# Altium schematic sheet HIGHSPEED_v0_NM.SchDoc
size A2
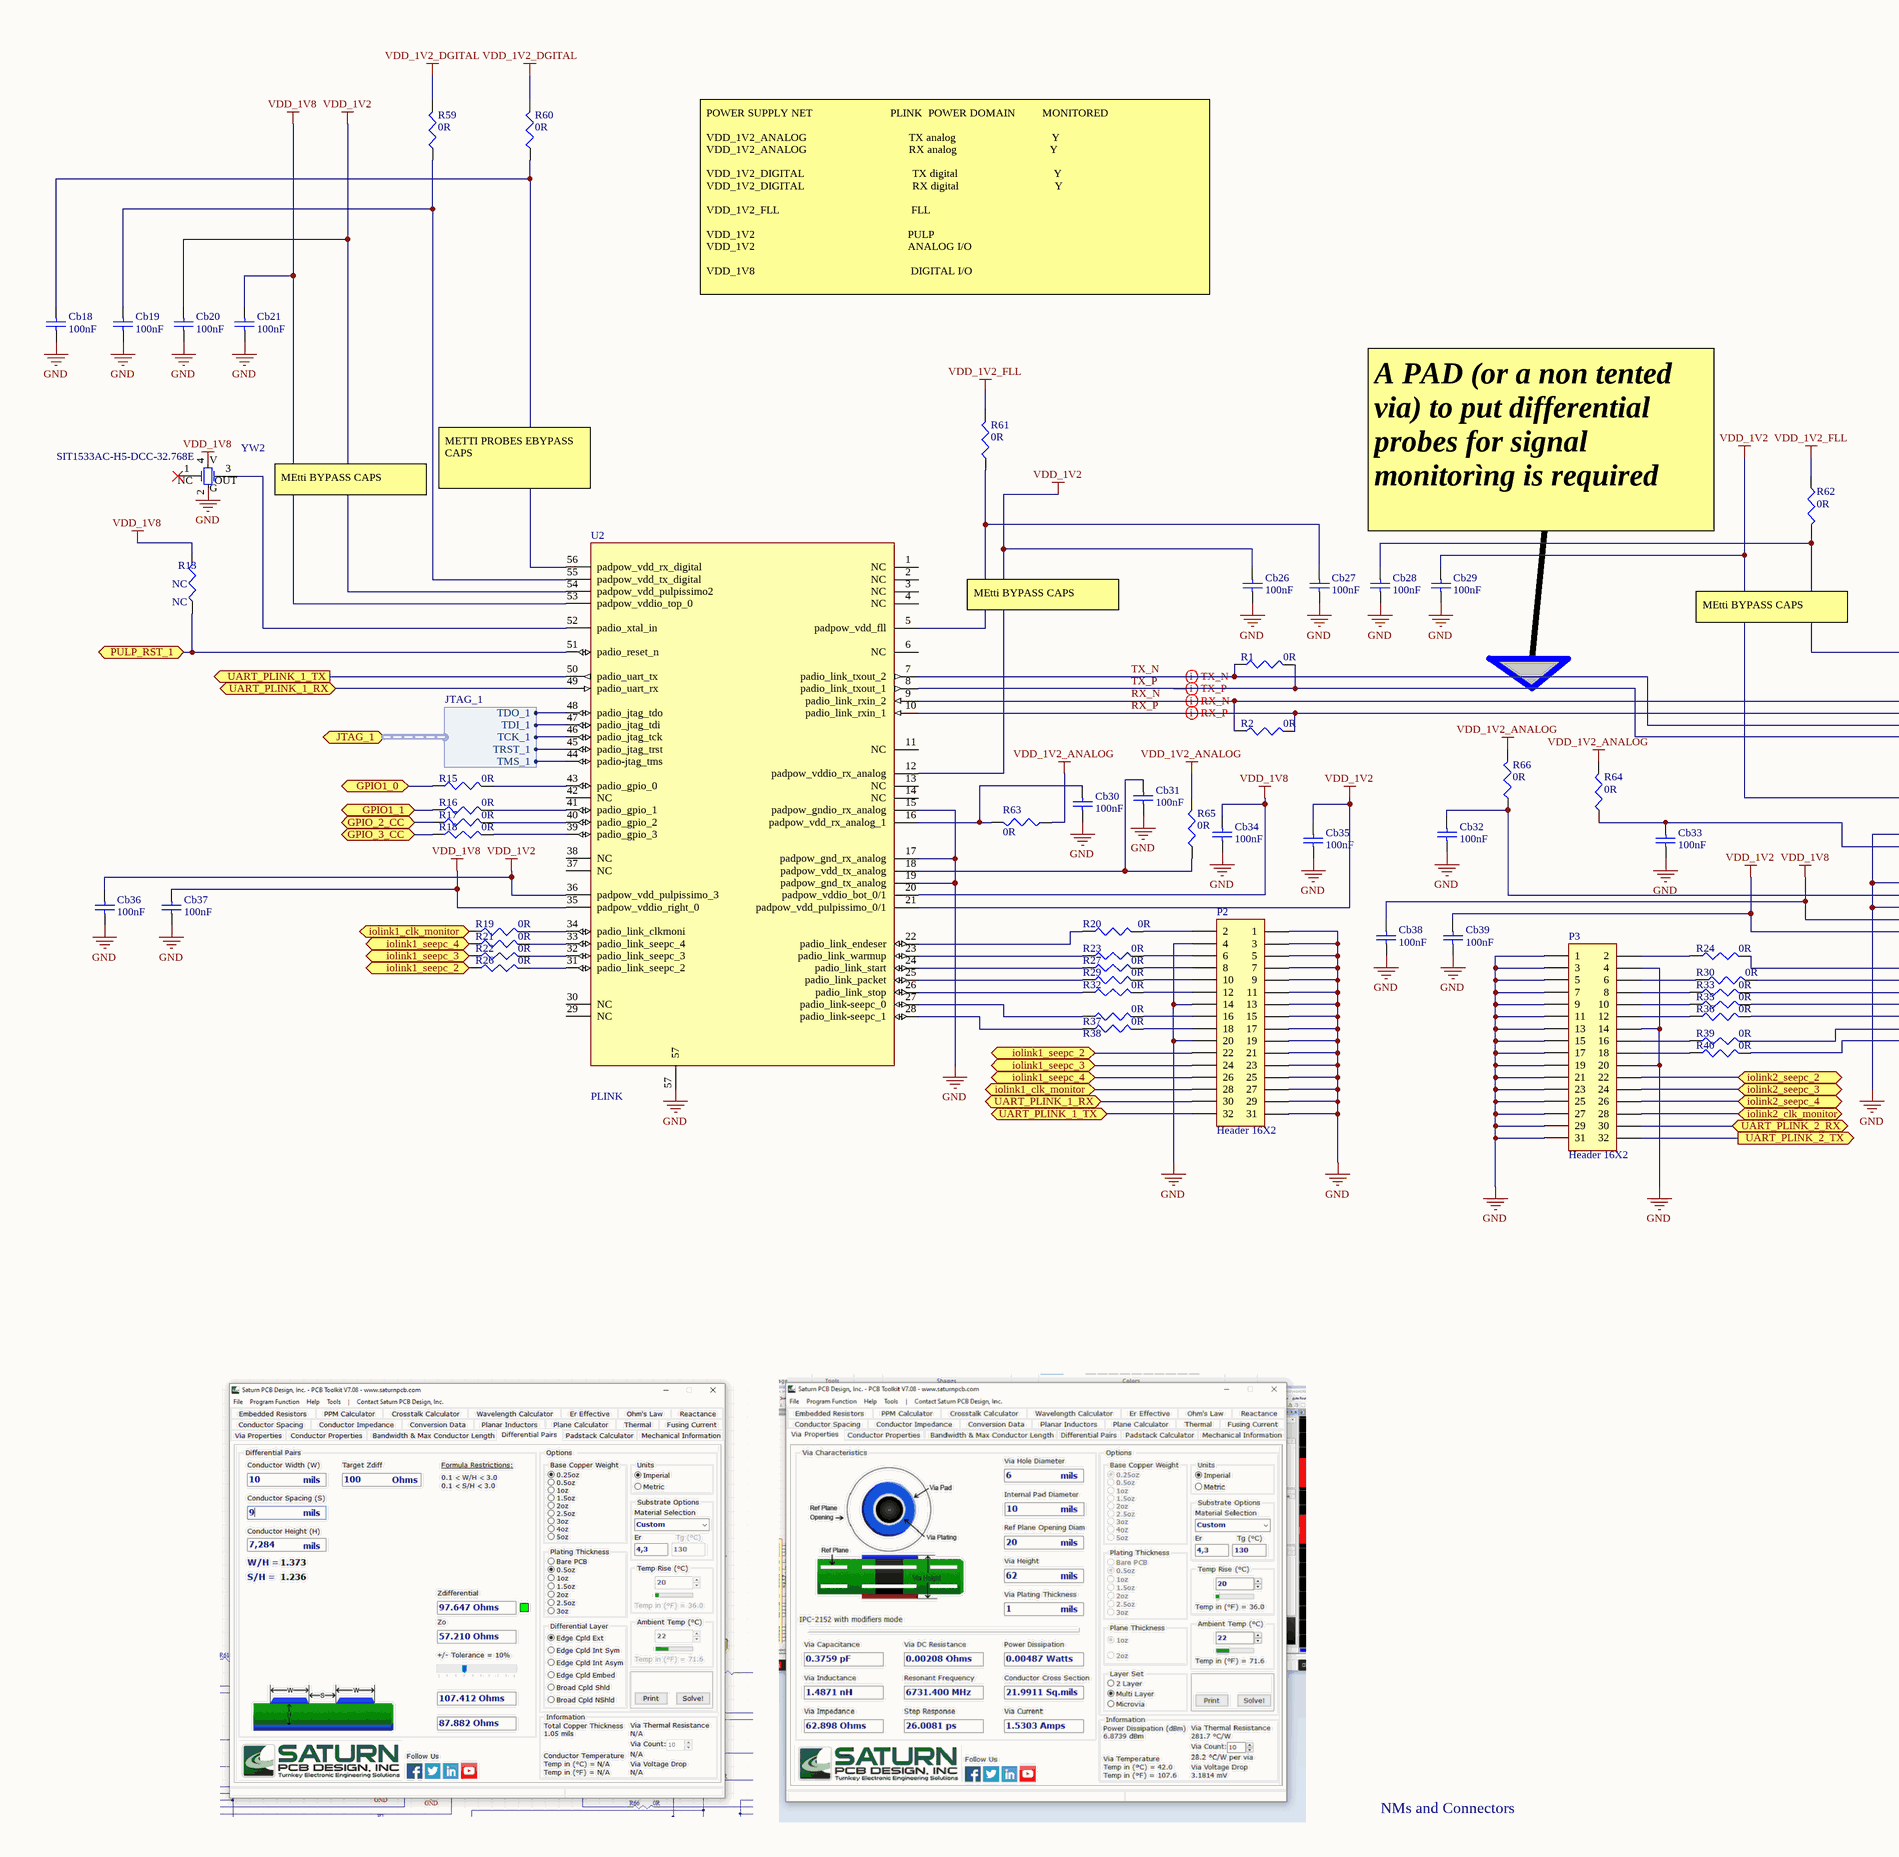
[diagram p0: HIGHSPEED_v0_NM.SchDoc, left]
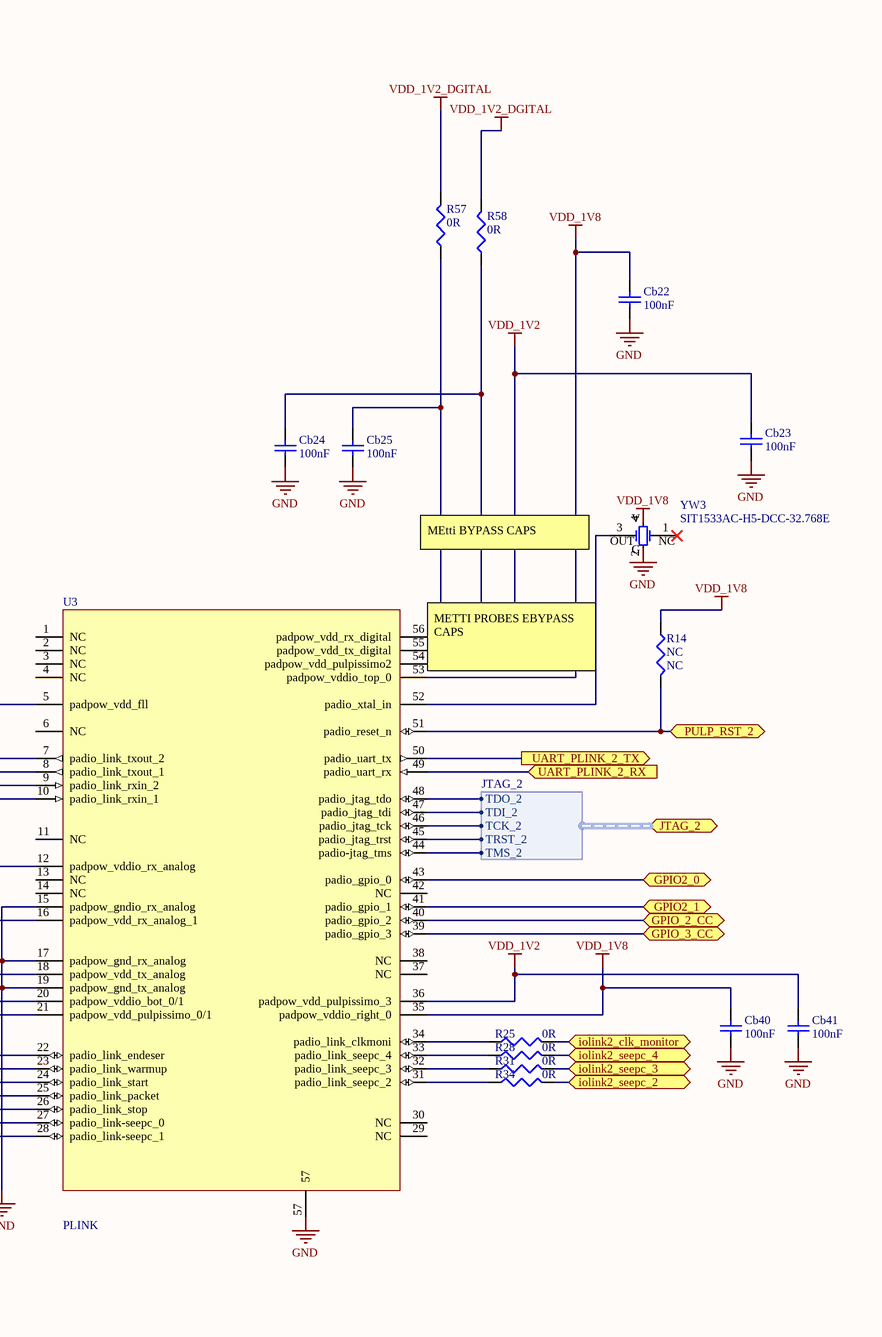
[diagram p1: HIGHSPEED_v0_NM.SchDoc, right]

## Parts
Cb18  value 100nF  [c0603-Murata-GR]  (hidden comment: GRM187R61A226ME15D)
Cb19  value 100nF  [c0603-Murata-GR]  (hidden comment: GRM187R61A226ME15D)
Cb20  value 100nF  [c0603-Murata-GR]  (hidden comment: GRM187R61A226ME15D)
Cb21  value 100nF  [c0603-Murata-GR]  (hidden comment: GRM187R61A226ME15D)
Cb22  value 100nF  [c0603-Murata-GR]  (hidden comment: GRM187R61A226ME15D)
Cb23  value 100nF  [c0603-Murata-GR]  (hidden comment: GRM187R61A226ME15D)
Cb24  value 100nF  [c0603-Murata-GR]  (hidden comment: GRM187R61A226ME15D)
Cb25  value 100nF  [c0603-Murata-GR]  (hidden comment: GRM187R61A226ME15D)
Cb26  value 100nF  [c0603-Murata-GR]  (hidden comment: GRM187R61A226ME15D)
Cb27  value 100nF  [c0603-Murata-GR]  (hidden comment: GRM187R61A226ME15D)
Cb28  value 100nF  [c0603-Murata-GR]  (hidden comment: GRM187R61A226ME15D)
Cb29  value 100nF  [c0603-Murata-GR]  (hidden comment: GRM187R61A226ME15D)
Cb30  value 100nF  [c0603-Murata-GR]  (hidden comment: GRM187R61A226ME15D)
Cb31  value 100nF  [c0603-Murata-GR]  (hidden comment: GRM187R61A226ME15D)
Cb32  value 100nF  [c0603-Murata-GR]  (hidden comment: GRM187R61A226ME15D)
Cb33  value 100nF  [c0603-Murata-GR]  (hidden comment: GRM187R61A226ME15D)
Cb34  value 100nF  [c0603-Murata-GR]  (hidden comment: GRM187R61A226ME15D)
Cb35  value 100nF  [c0603-Murata-GR]  (hidden comment: GRM187R61A226ME15D)
Cb36  value 100nF  [c0603-Murata-GR]  (hidden comment: GRM187R61A226ME15D)
Cb37  value 100nF  [c0603-Murata-GR]  (hidden comment: GRM187R61A226ME15D)
Cb38  value 100nF  [c0603-Murata-GR]  (hidden comment: GRM187R61A226ME15D)
Cb39  value 100nF  [c0603-Murata-GR]  (hidden comment: GRM187R61A226ME15D)
Cb40  value 100nF  [c0603-Murata-GR]  (hidden comment: GRM187R61A226ME15D)
Cb41  value 100nF  [c0603-Murata-GR]  (hidden comment: GRM187R61A226ME15D)
P2  Header 16X2  [HDR2X16]
P3  Header 16X2  [HDR2X16]
R1  0R  [J1-0603]
R2  0R  [J1-0603]
R13  NC  [0402]
R14  NC  [0402]
R15  0R  [0402]
R16  0R  [0402]
R17  0R  [0402]
R18  0R  [0402]
R19  0R  [0402]
R20  0R  [0402]
R21  0R  [0402]
R22  0R  [0402]
R23  0R  [0402]
R24  0R  [0402]
R25  0R  [0402]
R26  0R  [0402]
R27  0R  [0402]
R28  0R  [0402]
R29  0R  [0402]
R30  0R  [0402]
R31  0R  [0402]
R32  0R  [0402]
R33  0R  [0402]
R34  0R  [0402]
R35  0R  [0402]
R36  0R  [0402]
R37  0R  [0402]
R38  0R  [0402]
R39  0R  [0402]
R40  0R  [0402]
R57  0R  [C1206]
R58  0R  [C1206]
R59  0R  [C1206]
R60  0R  [C1206]
R61  0R  [C1206]
R62  0R  [C1206]
R63  0R  [C1206]
R64  0R  [C1206]
R65  0R  [C1206]
R66  0R  [C1206]
U2  PLINK  [QFN56_M]
U3  PLINK  [QFN56_M]
YW2  SIT1533AC-H5-DCC-32.768E  [SiT1533-C]
YW3  SIT1533AC-H5-DCC-32.768E  [SiT1533-C]

## Ports
GPIO1_0 (bidir), GPIO1_1 (bidir), GPIO2_0 (bidir), GPIO2_1 (bidir), GPIO_2_CC (bidir), GPIO_3_CC (bidir), iolink1_clk_monitor (bidir), iolink1_seepc_2 (bidir), iolink1_seepc_3 (bidir), iolink1_seepc_4 (bidir), iolink2_clk_monitor (bidir), iolink2_seepc_2 (bidir), iolink2_seepc_3 (bidir), iolink2_seepc_4 (bidir), JTAG_1 (harness JTAG_1), JTAG_2 (harness JTAG_2), PULP_RST_1 (bidir), PULP_RST_2 (bidir), UART_PLINK_1_RX (bidir), UART_PLINK_1_TX, UART_PLINK_1_TX (out), UART_PLINK_2_RX, UART_PLINK_2_RX (in), UART_PLINK_2_TX (out)

## Harnesses
JTAG_1: TCK_1, TDI_1, TDO_1, TMS_1, TRST_1
JTAG_2: TCK_2, TDI_2, TDO_2, TMS_2, TRST_2

## Nets
GND: Cb18.1 Cb19.1 Cb20.1 Cb21.1 Cb22.1 Cb23.1 Cb24.1 Cb25.1 Cb26.1 Cb27.1 Cb28.1 Cb29.1 Cb30.1 Cb31.1 Cb32.1 Cb33.1 Cb34.1 Cb35.1 Cb36.1 Cb37.1 Cb38.1 Cb39.1 Cb40.1 Cb41.1 P2.1 P2.3 P2.4 P2.5 P2.7 P2.9 P2.11 P2.13 P2.14 P2.15 P2.17 P2.19 P2.20 P2.21 P2.23 P2.25 P2.27 P2.29 P2.31 P3.1 P3.3 P3.4 P3.5 P3.7 P3.9 P3.11 P3.13 P3.14 P3.15 P3.17 P3.19 P3.20 P3.21 P3.23 P3.25 P3.27 P3.29 P3.31 U2.15(padpow_gndio_rx_analog) U2.17(padpow_gnd_rx_analog) U2.19(padpow_gnd_tx_analog) U2.57 U3.15(padpow_gndio_rx_analog) U3.17(padpow_gnd_rx_analog) U3.19(padpow_gnd_tx_analog) U3.57 YW2.2(GND) YW3.2(GND)
VDD_1V2: Cb20.2 Cb23.2 Cb26.2 Cb29.2 Cb35.2 Cb36.2 Cb39.2 Cb41.2 U2.12(padpow_vddio_rx_analog) U2.21(padpow_vdd_pulpissimo_0/1) U2.36(padpow_vdd_pulpissimo_3) U2.54(padpow_vdd_pulpissimo2) U3.12(padpow_vddio_rx_analog) U3.21(padpow_vdd_pulpissimo_0/1) U3.36(padpow_vdd_pulpissimo_3) U3.54(padpow_vdd_pulpissimo2)
VDD_1V2_ANALOG: R63.2 R64.1 R65.1 R66.1
VDD_1V2_DGITAL: R57.1 R58.1 R59.1 R60.1
VDD_1V2_FLL: R61.1 R62.2
VDD_1V8: Cb21.2 Cb22.2 Cb34.2 Cb37.2 Cb38.2 Cb40.2 R13.2 R14.2 U2.20(padpow_vddio_bot_0/1) U2.35(padpow_vddio_right_0) U2.53(padpow_vddio_top_0) U3.20(padpow_vddio_bot_0/1) U3.35(padpow_vddio_right_0) U3.53(padpow_vddio_top_0) YW2.4(VDD) YW3.4(VDD)
GPIO1_0: R15.2 ; port GPIO1_0
GPIO1_1: R16.2 ; port GPIO1_1
GPIO2_0: U3.43(padio_gpio_0) ; port GPIO2_0
GPIO2_1: U3.41(padio_gpio_1) ; port GPIO2_1
GPIO_2_CC: R17.2 U3.40(padio_gpio_2) ; port GPIO_2_CC
GPIO_3_CC: R18.2 U3.39(padio_gpio_3) ; port GPIO_3_CC
iolink1_clk_monitor: P2.28 R19.2 ; port iolink1_clk_monitor
iolink1_seepc_2: P2.22 R26.2 ; port iolink1_seepc_2
iolink1_seepc_3: P2.24 R22.2 ; port iolink1_seepc_3
iolink1_seepc_4: P2.26 R21.2 ; port iolink1_seepc_4
iolink2_clk_monitor: P3.28 R25.1 ; port iolink2_clk_monitor
iolink2_seepc_2: P3.22 R34.1 ; port iolink2_seepc_2
iolink2_seepc_3: P3.24 R31.1 ; port iolink2_seepc_3
iolink2_seepc_4: P3.26 R28.1 ; port iolink2_seepc_4
PULP_RST_1: R13.1 U2.51(padio_reset_n) ; port PULP_RST_1
PULP_RST_2: R14.1 U3.51(padio_reset_n) ; port PULP_RST_2
RX_N: R2.2 U2.9(padio_link_rxin_2) U3.7(padio_link_txout_2)
RX_P: R2.1 U2.10(padio_link_rxin_1) U3.8(padio_link_txout_1)
TX_N: R1.2 U2.7(padio_link_txout_2) U3.9(padio_link_rxin_2)
TX_P: R1.1 U2.8(padio_link_txout_1) U3.10(padio_link_rxin_1)
UART_PLINK_1_RX: P2.30 U2.49(padio_uart_rx) ; port UART_PLINK_1_RX
UART_PLINK_1_TX: P2.32 U2.50(padio_uart_tx) ; port UART_PLINK_1_TX
UART_PLINK_2_RX: P3.30 U3.49(padio_uart_rx) ; port UART_PLINK_2_RX
UART_PLINK_2_TX: P3.32 U3.50(padio_uart_tx) ; port UART_PLINK_2_TX
NetCb18_2: Cb18.2 R60.2 U2.56(padpow_vdd_rx_digital)
NetCb19_2: Cb19.2 R59.2 U2.55(padpow_vdd_tx_digital)
NetCb24_2: Cb24.2 R58.2 U3.55(padpow_vdd_tx_digital)
NetCb25_2: Cb25.2 R57.2 U3.56(padpow_vdd_rx_digital)
NetCb27_2: Cb27.2 R61.2 U2.5(padpow_vdd_fll)
NetCb28_2: Cb28.2 R62.1 U3.5(padpow_vdd_fll)
NetCb30_2: Cb30.2 R63.1 U2.16(padpow_vdd_rx_analog_1)
NetCb31_2: Cb31.2 R65.2 U2.18(padpow_vdd_tx_analog)
NetCb32_2: Cb32.2 R66.2 U3.18(padpow_vdd_tx_analog)
NetCb33_2: Cb33.2 R64.2 U3.16(padpow_vdd_rx_analog_1)
NetP2_2: P2.2 R20.2
NetP2_6: P2.6 R23.2
NetP2_8: P2.8 R27.2
NetP2_10: P2.10 R29.2
NetP2_12: P2.12 R32.2
NetP2_16: P2.16 R37.2
NetP2_18: P2.18 R38.2
NetP3_2: P3.2 R24.2
NetP3_6: P3.6 R30.2
NetP3_8: P3.8 R33.2
NetP3_10: P3.10 R35.2
NetP3_12: P3.12 R36.2
NetP3_16: P3.16 R39.2
NetP3_18: P3.18 R40.2
NetR15_1: R15.1 U2.43(padio_gpio_0)
NetR16_1: R16.1 U2.41(padio_gpio_1)
NetR17_1: R17.1 U2.40(padio_gpio_2)
NetR18_1: R18.1 U2.39(padio_gpio_3)
NetR19_1: R19.1 U2.34(padio_link_clkmoni)
NetR20_1: R20.1 U2.22(padio_link_endeser)
NetR21_1: R21.1 U2.33(padio_link_seepc_4)
NetR22_1: R22.1 U2.32(padio_link_seepc_3)
NetR23_1: R23.1 U2.23(padio_link_warmup)
NetR24_1: R24.1 U3.22(padio_link_endeser)
NetR25_2: R25.2 U3.34(padio_link_clkmoni)
NetR26_1: R26.1 U2.31(padio_link_seepc_2)
NetR27_1: R27.1 U2.24(padio_link_start)
NetR28_2: R28.2 U3.33(padio_link_seepc_4)
NetR29_1: R29.1 U2.25(padio_link_packet)
NetR30_1: R30.1 U3.23(padio_link_warmup)
NetR31_2: R31.2 U3.32(padio_link_seepc_3)
NetR32_1: R32.1 U2.26(padio_link_stop)
NetR33_1: R33.1 U3.24(padio_link_start)
NetR34_2: R34.2 U3.31(padio_link_seepc_2)
NetR35_1: R35.1 U3.25(padio_link_packet)
NetR36_1: R36.1 U3.26(padio_link_stop)
NetR37_1: R37.1 U2.27(padio_link-seepc_0)
NetR38_1: R38.1 U2.28(padio_link-seepc_1)
NetR39_1: R39.1 U3.27(padio_link-seepc_0)
NetR40_1: R40.1 U3.28(padio_link-seepc_1)
NetU2_44: U2.44(padio-jtag_tms) ; port JTAG_1.TMS_1
NetU2_45: U2.45(padio_jtag_trst) ; port JTAG_1.TRST_1
NetU2_46: U2.46(padio_jtag_tck) ; port JTAG_1.TCK_1
NetU2_47: U2.47(padio_jtag_tdi) ; port JTAG_1.TDI_1
NetU2_48: U2.48(padio_jtag_tdo) ; port JTAG_1.TDO_1
NetU2_52: U2.52(padio_xtal_in) YW2.3(OUT)
NetU3_44: U3.44(padio-jtag_tms) ; port JTAG_2.TMS_2
NetU3_45: U3.45(padio_jtag_trst) ; port JTAG_2.TRST_2
NetU3_46: U3.46(padio_jtag_tck) ; port JTAG_2.TCK_2
NetU3_47: U3.47(padio_jtag_tdi) ; port JTAG_2.TDI_2
NetU3_48: U3.48(padio_jtag_tdo) ; port JTAG_2.TDO_2
NetU3_52: U3.52(padio_xtal_in) YW3.3(OUT)

Not connected (* = marked no-connect by the designer): U2 1(NC) 2(NC) 3(NC) 4(NC) 6(NC) 11(NC) 13(NC) 14(NC) 29(NC) 30(NC) 37(NC) 38(NC) 42(NC); U3 1(NC) 2(NC) 3(NC) 4(NC) 6(NC) 11(NC) 13(NC) 14(NC) 29(NC) 30(NC) 37(NC) 38(NC) 42(NC); YW2 1(NC)*; YW3 1(NC)*

## Layout directives
differential pair: RX_N, RX_P, TX_N, TX_P

## Notes on the sheet
- POWER SUPPLY NET                          PLINK  POWER DOMAIN         MONITORED
  VDD_1V2_ANALOG                                  TX analog                                Y
  VDD_1V2_ANALOG                                  RX analog                               Y
  VDD_1V2_DIGITAL                                    TX digital                                Y
  VDD_1V2_DIGITAL                                    RX digital                                Y
  VDD_1V2_FLL                                            FLL
  VDD_1V2                                                   PULP
  VDD_1V2                                                   ANALOG I/O
  VDD_1V8                                                    DIGITAL I/O
- METTI PROBES EBYPASS CAPS
- MEtti BYPASS CAPS
- A PAD (or a non tented via) to put differential probes for signal monitorìng is required
- (near YW3) MEtti BYPASS CAPS
- (near U3) METTI PROBES EBYPASS CAPS
- NMs and Connectors
- (in symbol SIT-OSC32KHZ-SIT1533AC-H5-DCC-32.768) V; G

## Library data of the parts
Cb18-Cb41 = Cap: CAP CER 22UF 10V X5R 0603; Manufacturer: Murata; Note: 10V X5R 20%; Supplier: Digikey; Supplier PN: 490-13243-1-ND; Manufacturer PN: GRM187R61A226ME15D
P2 P3 = Header 16X2: Header, 16-Pin, Dual row; LatestRevisionDate: 17-Jul-2002; LatestRevisionNote: Re-released for DXP Platform.; Publisher: Altium Limited
R1 R2 R13-R40 R57-R66 = Res3: Resistor; Published: 8-Jun-2000; LatestRevisionDate: 29-May-2009; LatestRevisionNote: IPC-7351 Footprint Added.; PackageReference: J1-0603; Publisher: Altium Limited; PackageDescription: Chip Resistor
  R1 R2 R15-R40 R57-R66: Value: 0R
  R13 R14: Value: NC
YW2 YW3 = SIT-OSC32KHZ-SIT1533AC-H5-DCC-32.768: 20 ppm, Ultra-Low Power 32.768 kHz Quartz XTAL Replacement; Current - Supply (max): 1.3uA; ComponentLink1URL: http://www.sitime.com/products/datasheets/sit1533/SiT1533-datasheet.pdf; ComponentLink1Description: Datasheet; Frequency: 32.768kHz; Supplier 1: Digi-Key; Supplier Part Number 1: 1473-1515-2-ND; Supplier 2: Digi-Key; Supplier Part Number 2: 1473-1515-1-ND; Supplier 3: Digi-Key; Supplier Part Number 3: 1473-1515-6-ND; Supplier 4: Digi-Key; Supplier Part Number 4: 1473-1516-2-ND; Supplier 5: Digi-Key; Supplier Part Number 5: 1473-1516-1-ND; Supplier 6: Digi-Key; Supplier Part Number 6: 1473-1516-6-ND; Supplier 7: Digi-Key; Supplier Part Number 7: SIT1533AC-H5-DCC-32.768S-ND; Supplier 8: Digi-Key; Supplier Part Number 8: SIT1533AC-H5-DCC-32.768D-ND